# Altium project SSR.PrjPcb
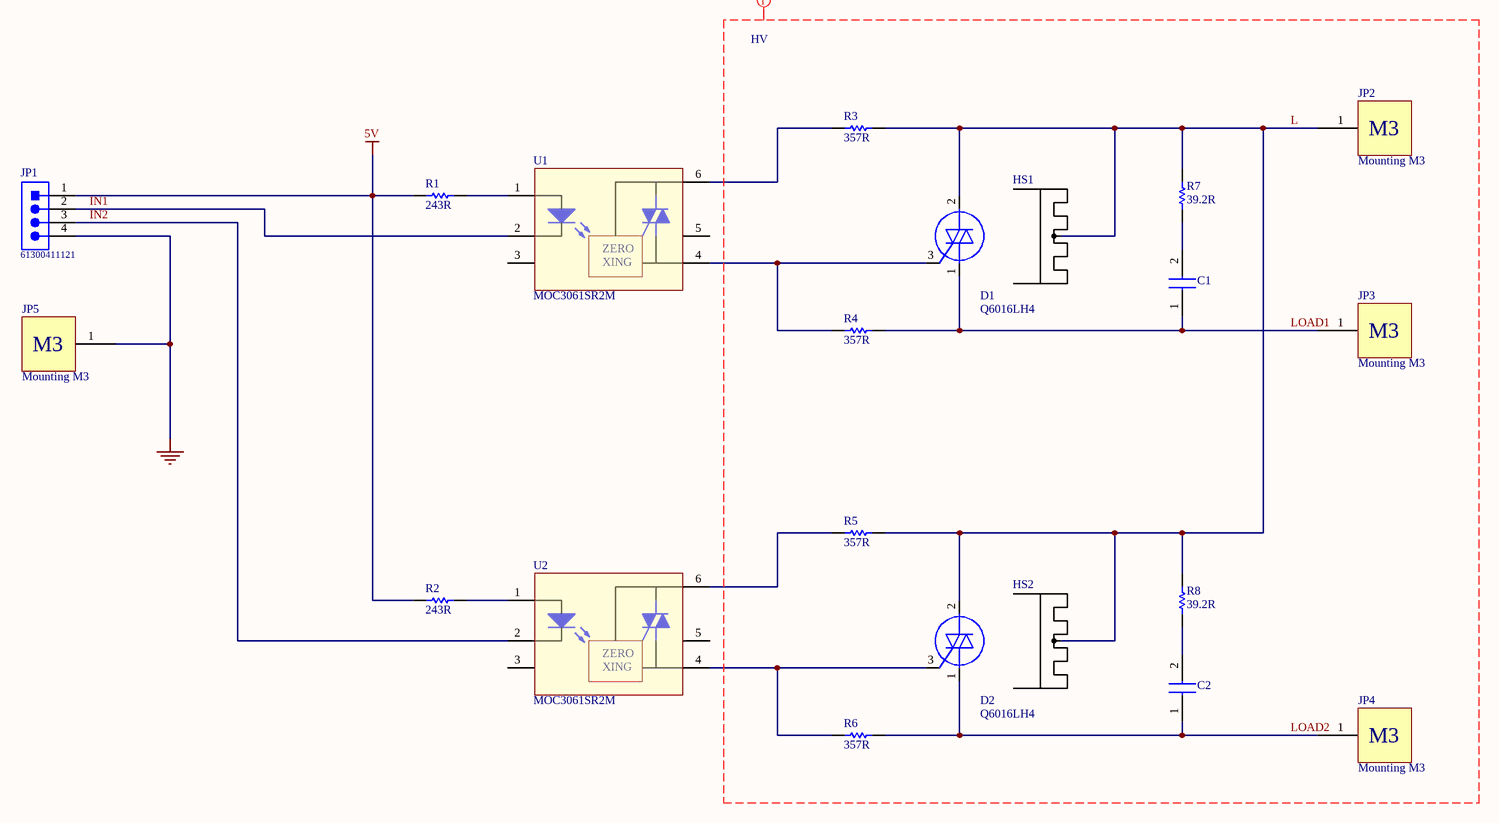
[diagram p0: SSR.SchDoc]
1 sheet, 21 parts. Net scope: global (net labels, ports and power ports of the same name join across sheets).
Board file: SSR.PcbDoc

## Sheet SSR.SchDoc
size A3; SheetNumber: 1; SheetTotal: 1

### Parts
C1  C1210C103JBTACAUTO  [CAPC3225X140N]  (value not drawn)
C2  C1210C103JBTACAUTO  [CAPC3225X140N]  (value not drawn)
D1  Q6016LH4  [TO254P478X1016X1956-3P]
D2  Q6016LH4  [TO254P478X1016X1956-3P]
HS1  HeatsinkTO220  [HeatsinkTO220]  (value not drawn)
HS2  HeatsinkTO220  [HeatsinkTO220]  (value not drawn)
JP1  61300411121  [61300411121]
JP2  Mounting M3  [M3]
JP3  Mounting M3  [M3]
JP4  Mounting M3  [M3]
JP5  Mounting M3  [M3]
R1  value 243R  [RES_0603_H050 (_IPC_MD)]  (hidden comment: 243R 1% 0,1W 75V 0603)
R2  value 243R  [RES_0603_H050 (_IPC_MD)]  (hidden comment: 243R 1% 0,1W 75V 0603)
R3  value 357R  [RES_1206_H060 (_IPC_MD)]  (hidden comment: 357R 1% 0,25W 200V 1206)
R4  value 357R  [RES_1206_H060 (_IPC_MD)]  (hidden comment: 357R 1% 0,25W 200V 1206)
R5  value 357R  [RES_1206_H060 (_IPC_MD)]  (hidden comment: 357R 1% 0,25W 200V 1206)
R6  value 357R  [RES_1206_H060 (_IPC_MD)]  (hidden comment: 357R 1% 0,25W 200V 1206)
R7  value 39.2R  [RES_1206_H060 (_IPC_MD)]  (hidden comment: 39.2R 1% 0,25W 200V 1206)
R8  value 39.2R  [RES_1206_H060 (_IPC_MD)]  (hidden comment: 39.2R 1% 0,25W 200V 1206)
U1  MOC3061SR2M  [SOT254P916X508-6N]
U2  MOC3061SR2M  [SOT254P916X508-6N]

### Nets
5V: JP1.1 R1.1 R2.1
GND: JP1.4 JP5.1
IN1: JP1.2 U1.2(K)
IN2: JP1.3 U2.2(K)
L: D1.2(MT2) D2.2(MT2) HS1.0 HS2.0 JP2.1 R3.2 R5.2 R7.1 R8.1
LOAD1: C1.1 D1.1(MT1) JP3.1 R4.2
LOAD2: C2.1 D2.1(MT1) JP4.1 R6.2
NetC1_2: C1.2 R7.2
NetC2_2: C2.2 R8.2
NetD1_3: D1.3(G) R4.1 U1.4(MAIN_TERM._1)
NetD2_3: D2.3(G) R6.1 U2.4(MAIN_TERM._1)
NetR1_2: R1.2 U1.1(ANODE)
NetR2_2: R2.2 U2.1(ANODE)
NetR3_1: R3.1 U1.6(MAIN_TERM._2)
NetR5_1: R5.1 U2.6(MAIN_TERM._2)

Not connected (* = marked no-connect by the designer): U1 3(N/C) 5(NC); U2 3(N/C) 5(NC)

### Layout directives
net class HV: L, LOAD1, LOAD2

### Notes on the sheet
- (in symbol CONNM3) M3
- (in symbol MOC3061SR2M) ZERO; XING

### Library data of the parts
C1 C2 = C1210C103JBTACAUTO: Capacitor; Manufacturer_Name: Kemet; Datasheet Link: https://www.kemet.com/specsheet/C1210C103JBTACAUTO; Height: 1.4mm; Manufacturer_Part_Number: C1210C103JBTACAUTO; Mouser Part Number: 80-C1210C103JBTAUTO; Mouser Price/Stock: https://www.mouser.co.uk/ProductDetail/KEMET/C1210C103JBTACAUTO?qs=QNEnbhJQKvaXscHrCOz9wA%3D%3D
D1 D2 = Q6016LH4: Thyristor; Manufacturer_Name: LITTELFUSE; Datasheet Link: https://www.littelfuse.com/~/media/electronics/datasheets/switching_thyristors/littelfuse_thyristor_qxx15xx_qxx16xhx_datasheet.pdf.pdf; Height: 4.78mm; Manufacturer_Part_Number: Q6016LH4
HS1 HS2 = HeatsinkTO220: Simple model for a cheap Aliexpress 20*15*11 TO-220 pure aluminium heat sink; Designator: HS?; Temp: I; Part Number: HeatsinkTO220; Component: HeatsinkTO220; Type: Mechanical; Qty: 1; Supplier 1: Arrow; Supplier 2: Avnet; Supplier 3: Digi-Key; Supplier 4: Distrelec; Supplier 5: Farnell; Supplier 6: Future Electronics; Supplier 7: Mouser; Supplier 8: RSComponents; Supplier 9: Rutronik; Supplier 10: TTI
JP1 = 61300411121: WR-PHD Pin Header, THT, pitch 2.54mm, Single Row, Vertical, 4p; Manufacturer: Wurth Elektronik; Pin Number: 4; Rated Current: 3A; Working Voltage: 250VAC; Withstanding Voltage: 500VAC; Contact Resistance: 20mOhm; ComponentLink1Description: Manufacturer; ComponentLink1URL: http://www.we-online.de; ComponentLink2Description: Datasheet; ComponentLink2URL: https://www.we-online.com/catalog/datasheet/61300411121.pdf; Manufacturer Part Number: 61300411121; Pitch: 2.54mm; Operating Temperature: -40 to +105degC; Mounting Technology: THT; Packaging: Bag; Gender: Pin Header; Row Number: Single; Orientation: Vertical
JP2-JP5 = CONNM3
R1 R2 = RES243R1%0603: Designator: R; PCB Lib: MUAB_RES.PcbLib; Scm Lib: Discrete.SchLib; Watt: 0,1W; Tol: 1%; Part Number: RES243R1%0603; Type: Standard; Volt: 75V; Qty: 1; Supplier 1: Arrow; Supplier 2: Avnet; Supplier 3: Digi-Key; Supplier 4: Distrelec; Supplier 5: Farnell; Supplier 6: Future Electronics; Supplier 7: Mouser; Supplier 8: RSComponents; Supplier 9: Rutronik; Supplier 10: SEED OPL
R3-R6 = RES357R1%1206: Designator: R; PCB Lib: MUAB_RES.PcbLib; Scm Lib: Discrete.SchLib; Watt: 0,25W; Tol: 1%; Part Number: RES357R1%1206; Type: Standard; Volt: 200V; Qty: 1; Supplier 1: Arrow; Supplier 2: Avnet; Supplier 3: Digi-Key; Supplier 4: Distrelec; Supplier 5: Farnell; Supplier 6: Future Electronics; Supplier 7: Mouser; Supplier 8: RSComponents; Supplier 9: Rutronik; Supplier 10: SEED OPL
R7 R8 = RES39.2R1%1206: Designator: R; PCB Lib: MUAB_RES.PcbLib; Scm Lib: Discrete.SchLib; Watt: 0,25W; Tol: 1%; Part Number: RES39.2R1%1206; Type: Standard; Volt: 200V; Qty: 1; Supplier 1: Arrow; Supplier 2: Avnet; Supplier 3: Digi-Key; Supplier 4: Distrelec; Supplier 5: Farnell; Supplier 6: Future Electronics; Supplier 7: Mouser; Supplier 8: RSComponents; Supplier 9: Rutronik; Supplier 10: SEED OPL
U1 U2 = MOC3061SR2M: Integrated Circuit; Manufacturer_Name: ON Semiconductor; Datasheet Link: http://www.onsemi.com/pub/Collateral/MOC3163M-D.pdf; Height: 5.08mm; Manufacturer_Part_Number: MOC3061SR2M; Mouser Part Number: 512-MOC3061SR2M; Mouser Price/Stock: https://www.mouser.co.uk/ProductDetail/ON-Semiconductor-Fairchild/MOC3061SR2M?qs=QsyUFYHC2%2FbVF%2F%252BX5tJ1cA%3D%3D; Arrow Part Number: MOC3061SR2M; Arrow Price/Stock: https://www.arrow.com/en/products/moc3061sr2m/on-semiconductor?region=nac